# Altium schematic sheet rasp_sheild_main.SchDoc
size Tabloid; SheetNumber: 2; SheetTotal: 5; Sheet_Name: RaspberryPi Frigorus Sheild; Size: 11x17
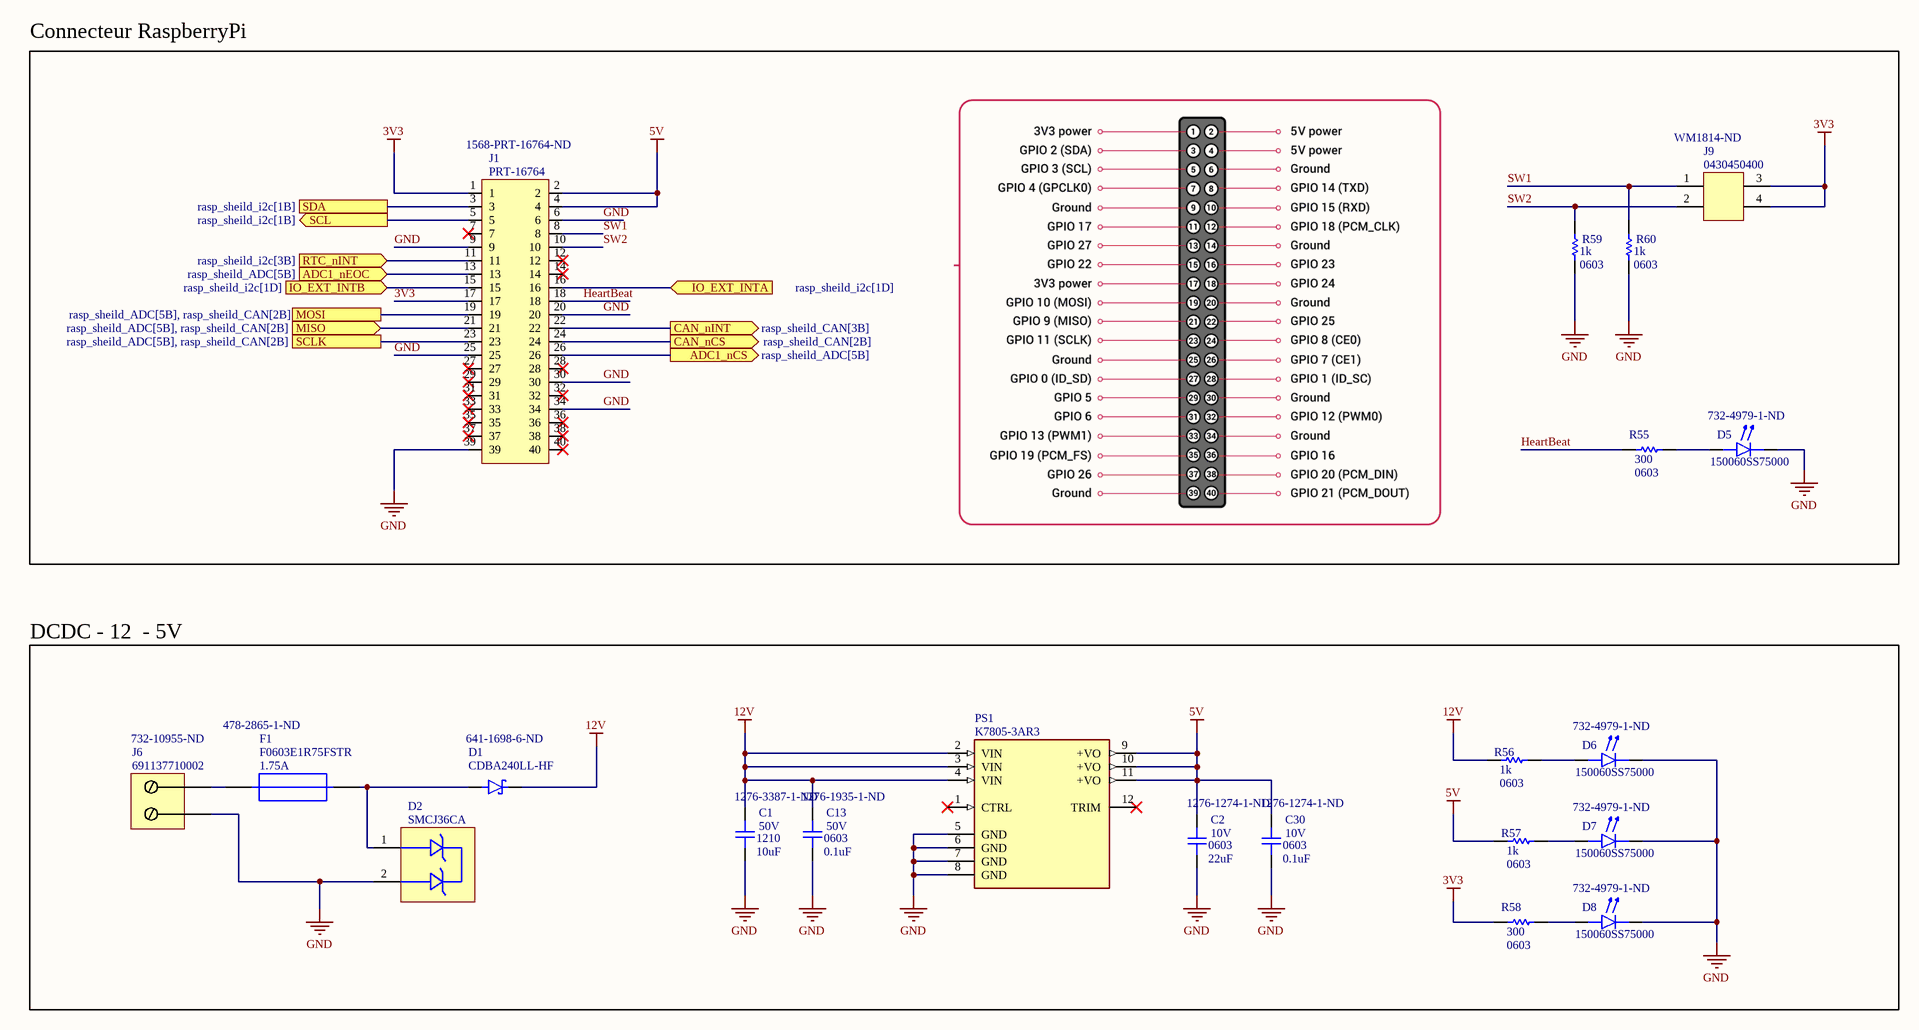
[diagram p0: rasp_sheild_main.SchDoc]

## Parts
C1  value 10uF  Voltage Rating: 50V  Package: 1210  Supplier Part Number 1: 1276-3387-1-ND  [CAP_1210]  (hidden comment: CL32B106KBJNNNE)
C2  value 22uF  Voltage Rating: 10V  Package: 0603  Supplier Part Number 1: 1276-1274-1-ND  [CAP_0603]  (hidden comment: CL10A226MP8NUNE)
C13  value 0.1uF  Voltage Rating: 50V  Package: 0603  Supplier Part Number 1: 1276-1935-1-ND  [CAP_0603]  (hidden comment: CL10B104KB8NNWC)
C30  value 0.1uF  Voltage Rating: 10V  Package: 0603  Supplier Part Number 1: 1276-1274-1-ND  [CAP_0603]  (hidden comment: CL10A226MP8NUNE)
D1  CDBA240LL-HF  Supplier Part Number 1: 641-1698-6-ND  [DO-214]
D2  SMCJ36CA  [SMCJ36CA]
D5  150060SS75000  Supplier Part Number 1: 732-4979-1-ND  [LED 0603]
D6  150060SS75000  Supplier Part Number 1: 732-4979-1-ND  [LED 0603]
D7  150060SS75000  Supplier Part Number 1: 732-4979-1-ND  [LED 0603]
D8  150060SS75000  Supplier Part Number 1: 732-4979-1-ND  [LED 0603]
F1  F0603E1R75FSTR  value 1.75A  Supplier Part Number 1: 478-2865-1-ND  [RES_0603]
J1  PRT-16764  Supplier Part Number 1: 1568-PRT-16764-ND  [PRT-16764]
J6  691137710002  Supplier Part Number 1: 732-10955-ND  [691137710002]
J9  0430450400  Supplier Part Number 1: WM1814-ND  [0430450400]
PS1  K7805-3AR3  [CONV_K7805-3AR3]
R55  value 300  Package: 0603  [RES_0603]  (hidden comment: RC0603JR-07300RL)
R56  value 1k  Package: 0603  [RES_0603]  (hidden comment: Part Number)
R57  value 1k  Package: 0603  [RES_0603]  (hidden comment: Part Number)
R58  value 300  Package: 0603  [RES_0603]  (hidden comment: RC0603JR-07300RL)
R59  value 1k  Package: 0603  [RES_0603]  (hidden comment: Part Number)
R60  value 1k  Package: 0603  [RES_0603]  (hidden comment: Part Number)

## Blocks framed on the sheet
Connecteur RaspberryPi: D5 J1 J9 R55 R59 R60
DCDC - 12  - 5V: C1 C2 C13 C30 D1 D2 D6-D8 F1 J6 PS1 R56-R58

## Ports
ADC1_nCS (out, see rasp_sheild_ADC[5B]), ADC1_nEOC (in, see rasp_sheild_ADC[5B]), CAN_nCS (out, see rasp_sheild_CAN[2B]), CAN_nINT (out, see rasp_sheild_CAN[3B]), IO_EXT_INTA (in, see rasp_sheild_i2c[1D]), IO_EXT_INTB (in, see rasp_sheild_i2c[1D]), MISO (in, see rasp_sheild_ADC[5B], rasp_sheild_CAN[2B]), MOSI (see rasp_sheild_ADC[5B], rasp_sheild_CAN[2B]), RTC_nINT (in, see rasp_sheild_i2c[3B]), SCL (out, see rasp_sheild_i2c[1B]), SCLK (see rasp_sheild_ADC[5B], rasp_sheild_CAN[2B]), SDA (see rasp_sheild_i2c[1B])

## Nets
3V3: J1.1 J1.17 J9.3 J9.4 R58.2
5V: C2.2 C30.2 J1.2 J1.4 PS1.9(+VO) PS1.10(+VO) PS1.11(+VO) R57.2
12V: C1.2 C13.2 D1.C(K) PS1.2(VIN) PS1.3(VIN) PS1.4(VIN) R56.2
GND: C1.1 C2.1 C13.1 C30.1 D2.2 D5.K D6.K D7.K D8.K J1.6 J1.9 J1.20 J1.25 J1.30 J1.34 J1.39 J6.2 PS1.5(GND) PS1.6(GND) PS1.7(GND) PS1.8(GND) R59.1 R60.1
ADC1_nCS: J1.26 ; port ADC1_nCS
ADC1_nEOC: J1.13 ; port ADC1_nEOC
CAN_nCS: J1.24 ; port CAN_nCS
CAN_nINT: J1.22 ; port CAN_nINT
HeartBeat: J1.18 R55.2
IO_EXT_INTA: J1.16 ; port IO_EXT_INTA
IO_EXT_INTB: J1.15 ; port IO_EXT_INTB
MISO: J1.21 ; port MISO
MOSI: J1.19 ; port MOSI
RTC_nINT: J1.11 ; port RTC_nINT
SCL: J1.5 ; port SCL
SCLK: J1.23 ; port SCLK
SDA: J1.3 ; port SDA
SW1: J1.8 J9.1 R60.2
SW2: J1.10 J9.2 R59.2
NetD1_A: D1.A D2.1 F1.2
NetD5_A: D5.A R55.1
NetD6_A: D6.A R56.1
NetD7_A: D7.A R57.1
NetD8_A: D8.A R58.1
NetF1_1: F1.1 J6.1

Not connected (* = marked no-connect by the designer): J1 7* 12* 14* 27* 28* 29* 31* 32* 33* 35* 36* 37* 38* 40*; PS1 1(CTRL)* 12(TRIM)*

## Notes on the sheet
- Sheet Name
- Project Title
- Global Project
- Revision
- Size
- Date
- Group
- Sheet
- of
- Filename
- Designers

## Library data of the parts
C1 = CAP_1210: XXX - Description - Package; GRAMS Lib Spec: 2.7; Supplier 1: Digi-Key
C2 C13 C30 = CAP_0603: XXX - Description - Package; GRAMS Lib Spec: 2.7; Supplier 1: Digi-Key
D1 = CDBA240LL-HF: Diode 40 V 2A Surface Mount DO-214AC (SMA); GRAMS Lib Spec: 2.7; Supplier 1: Digi-Key
D2 = SMCJ36CA: 44.2V Clamp 25.8A Ipp Tvs Diode Surface Mount DO-214AB (SMC); GRAMS Lib Spec: 2.7
D5-D8 = 150060SS75000: Red 630nm LED Indication - Discrete 1.9V 0603 (1608 Metric); GRAMS Lib Spec: 2.7; Supplier 1: Digi-Key
F1 = F0603E1R75FSTR: 1.75 A AC 32 V DC Fuse Board Mount (Cartridge Style Excluded) Surface Mount 0603 (1608 Metric); GRAMS Lib Spec: 2.7; Supplier 1: Digi-Key
J1 = PRT-14275_1: EXTENDED GPIO FEMALE HEADER - 2X; GRAMS Lib Spec: 2.7; Supplier 1: Digi-Key
J6 = 691137710002: 2 Position Wire to Board Terminal Block Horizontal with Board 0.197" (5.00mm) Through Hole; GRAMS Lib Spec: 2.7; Supplier 1: Digi-Key
J9 = 0430450400: Connector Header Through Hole, Right Angle 4 position 0.118" (3.00mm); GRAMS Lib Spec: 2.7; Supplier 1: Digi-Key
PS1 = K7805-3AR3: Non-Isolated PoL Module DC DC Converter 1 Output 5V - - - 3A 8V - 36V Input; MF: Mornsun America, LLC; Value: *; SnapEDA_Link: https://www.snapeda.com/parts/K7805-3AR3/MORNSUN/view-part/?ref=snap; Purchase-URL: https://pricing.snapeda.com/search/part/K7805-3AR3/?ref=eda; Availability: In Stock; Price: None; Package: SIP-12-12 MORNSUN; Check_prices: https://www.snapeda.com/parts/K7805-3AR3/MORNSUN/view-part/?ref=eda; MP: K7805-3AR3; Supplier 1: Digi-Key; Supplier Part Number 1: 2725-K7805-3AR3-ND
R55-R60 = RES_0603: XXX - Description - Package; GRAMS Lib Spec: 2.7; Supplier 1: Digi-Key
  R55 R58: Supplier Part Number 1: 311-300GRCT-ND
  R56 R57 R59 R60: Supplier Part Number 1: 311-1.00KHRCT-ND